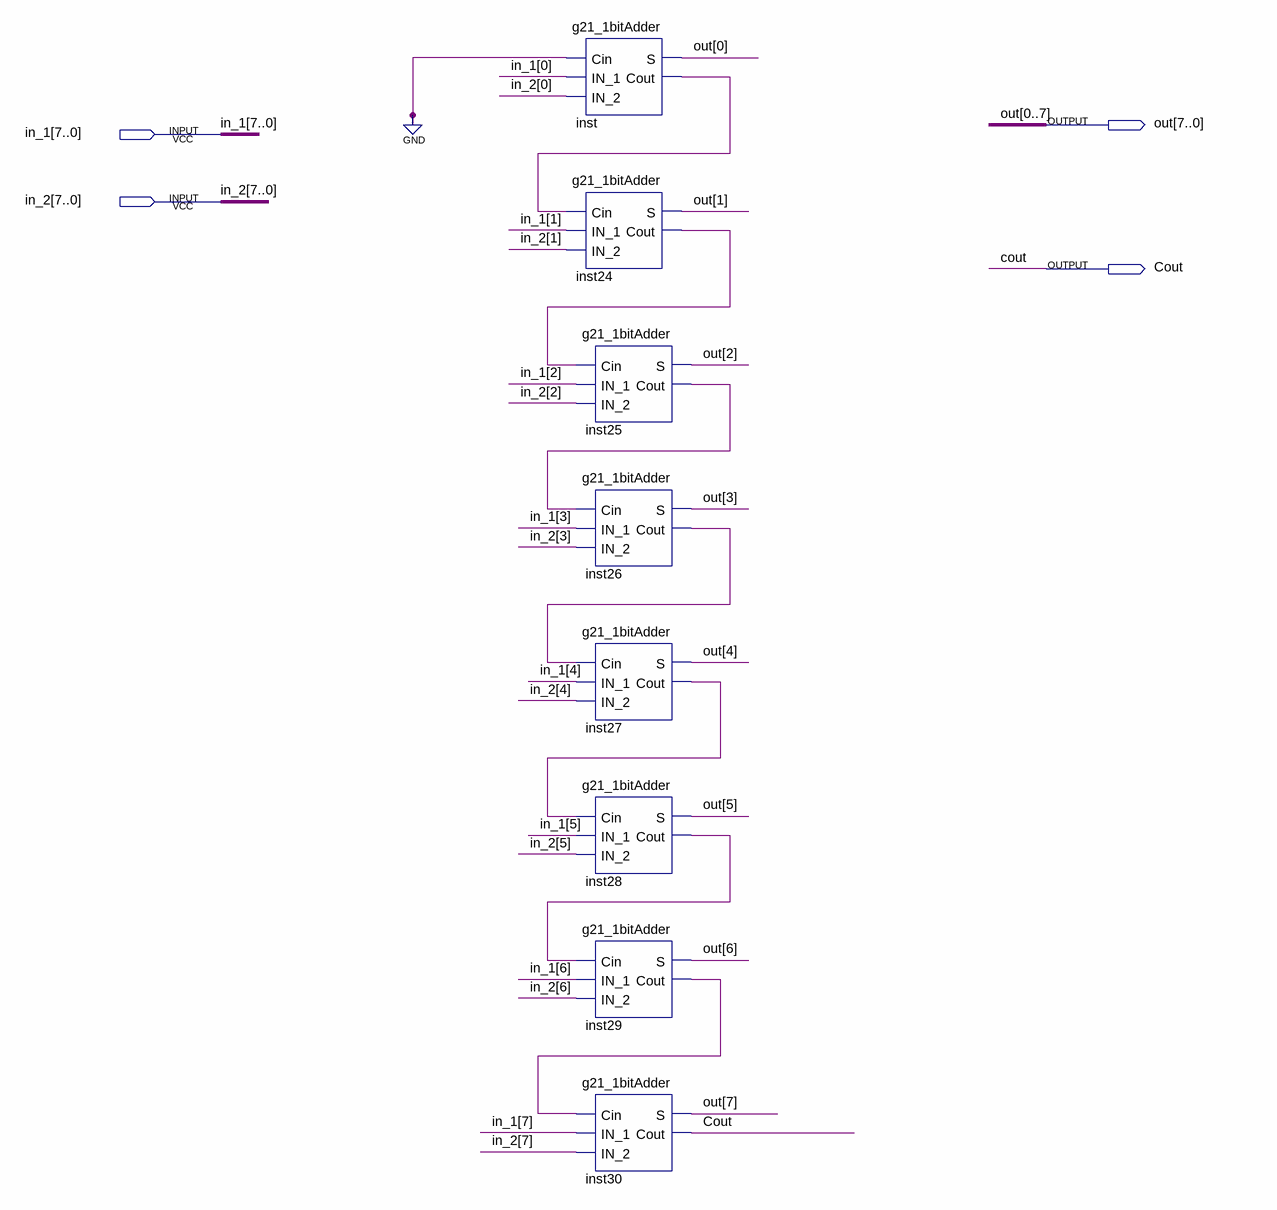
[diagram p0: schematic sheet]
// Quartus schematic g21_adder.bdf as structural Verilog: 8 symbols, 4 pins
module g21_adder (
  input  [7:0] in_1,
  input  [7:0] in_2,
  output [7:0] out,
  output Cout
);

  wire inst24_cout, inst25_cout, inst26_cout, inst27_cout, inst28_cout, inst29_cout, inst_cout;

  g21_1bitAdder inst (.Cin(1'b0), .IN_1(in_1[0]), .IN_2(in_2[0]), .S(out[0]), .Cout(inst_cout));
  g21_1bitAdder inst24 (.Cin(inst_cout), .IN_1(in_1[1]), .IN_2(in_2[1]), .S(out[1]), .Cout(inst24_cout));
  g21_1bitAdder inst25 (.Cin(inst24_cout), .IN_1(in_1[2]), .IN_2(in_2[2]), .S(out[2]), .Cout(inst25_cout));
  g21_1bitAdder inst26 (.Cin(inst25_cout), .IN_1(in_1[3]), .IN_2(in_2[3]), .S(out[3]), .Cout(inst26_cout));
  g21_1bitAdder inst27 (.Cin(inst26_cout), .IN_1(in_1[4]), .IN_2(in_2[4]), .S(out[4]), .Cout(inst27_cout));
  g21_1bitAdder inst28 (.Cin(inst27_cout), .IN_1(in_1[5]), .IN_2(in_2[5]), .S(out[5]), .Cout(inst28_cout));
  g21_1bitAdder inst29 (.Cin(inst28_cout), .IN_1(in_1[6]), .IN_2(in_2[6]), .S(out[6]), .Cout(inst29_cout));
  g21_1bitAdder inst30 (.Cin(inst29_cout), .IN_1(in_1[7]), .IN_2(in_2[7]), .S(out[7]), .Cout(Cout));
endmodule
